# Altium schematic sheet Sheet2.SchDoc
size A4; SheetNumber: 2; SheetTotal: 2
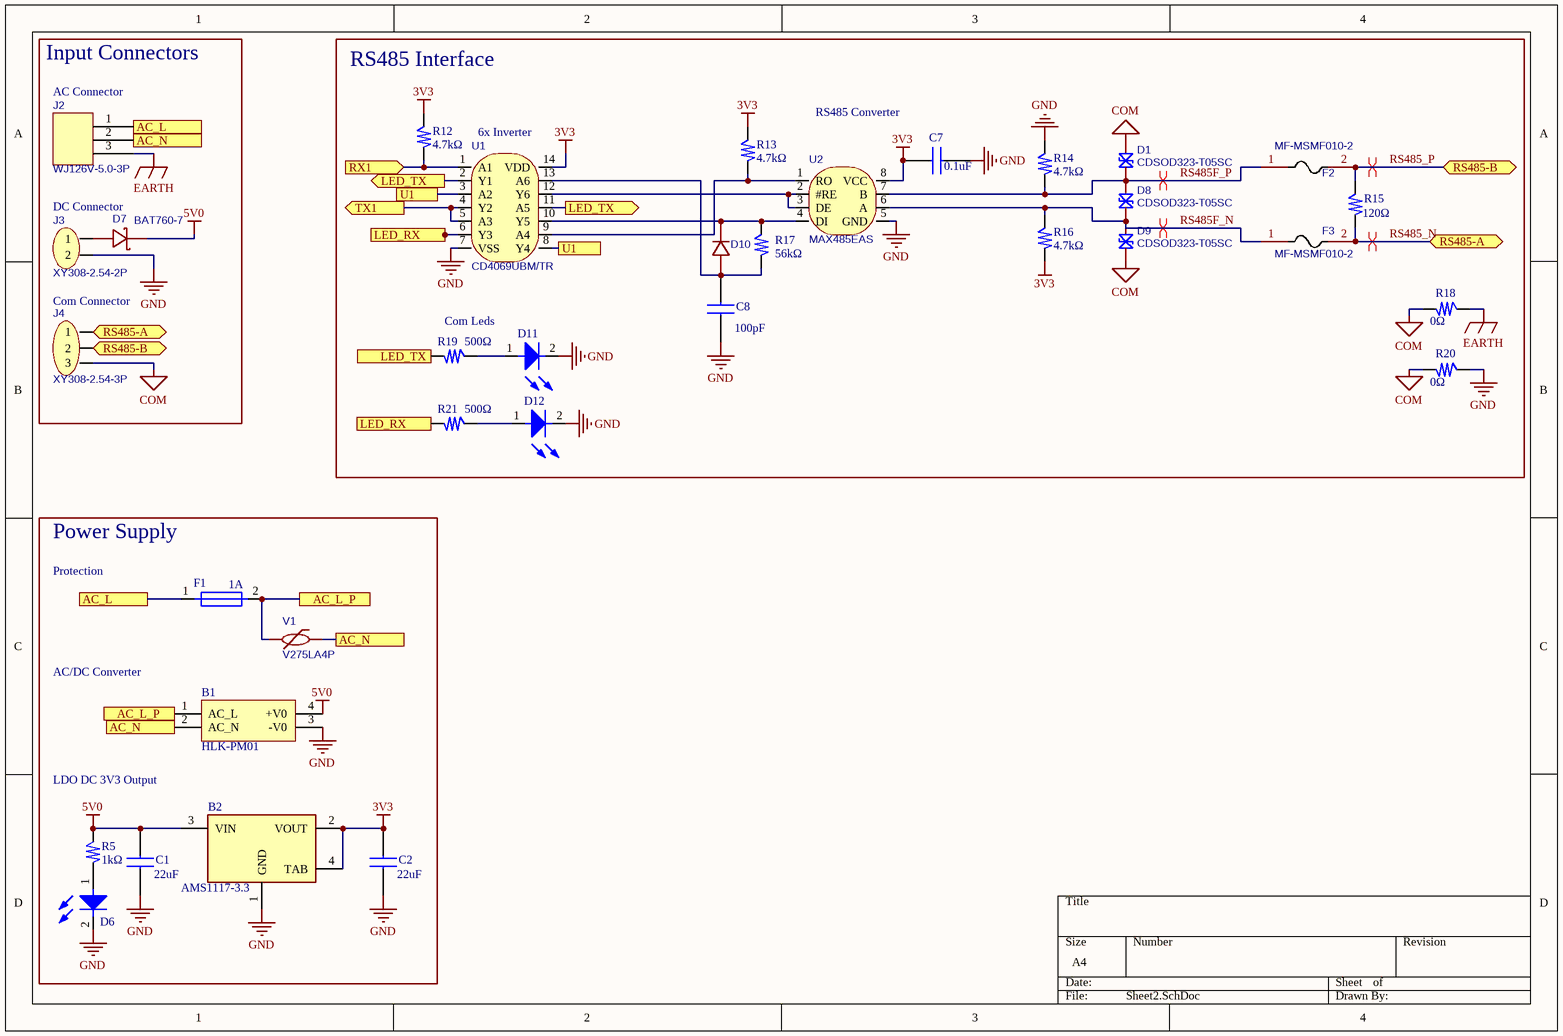
[diagram p0: Sheet2.SchDoc]

## Parts
B1  HLK-PM01  [HLKPM01]
B2  AMS1117-3.3  [SOT229P700X180-4N]
C1  value 22uF  [CAP0608N]  (hidden comment: CL10A226MP8NUNE)
C2  value 22uF  [CAP0608N]  (hidden comment: CL10A226MP8NUNE)
C7  value 0.1uF  [CAP0608N]  (hidden comment: CAP_0603_0.1UF_20%_50V_X5R)
C8  value 100pF  [CAP0608N]  (hidden comment: CAP_0603_100pF_5%_50V_C0G)
D1  CDSOD323-T05SC  [SOD-323_L1.8-W1.3-LS2.5-RD]
D6  0603_LED_GREEN_1.8V  [LED0603]  (value not drawn)
D7  BAT760-7  [SOD-323_L1.8-W1.3-LS2.5-RD]
D8  CDSOD323-T05SC  [SOD-323_L1.8-W1.3-LS2.5-RD]
D9  CDSOD323-T05SC  [SOD-323_L1.8-W1.3-LS2.5-RD]
D10  1N4148W T4  [SOD-123_L2.8-W1.8-LS3.7-RD]  (value not drawn)
D11  0603_LED_RED_1.9V  [LED0603]  (value not drawn)
D12  0603_LED_GREEN_1.8V  [LED0603]  (value not drawn)
F1  value 1A  [FUSE_TH_3x10]  (hidden comment: FUSE_TH_1A_GLASS)
F2  MF-MSMF010-2  [F1812]
F3  MF-MSMF010-2  [F1812]
J2  WJ126V-5.0-3P  [CONN-TH_3P-P5.00_WJ126V-5.0-3P]
J3  XY308-2.54-2P  [CONN-TH_XY308-2.54-2P]
J4  XY308-2.54-3P  [CONN-TH_XY308-2.54-3P]
R5  value 1kΩ  [RES0603N]  (hidden comment: RES_0603_1KOHM_0.1W)
R12  value 4.7kΩ  [RES0603N]  (hidden comment: RES_0603_4.7KOHM_0.1W)
R13  value 4.7kΩ  [RES0603N]  (hidden comment: RES_0603_4.7KOHM_0.1W)
R14  value 4.7kΩ  [RES0603N]  (hidden comment: RES_0603_4.7KOHM_0.1W)
R15  value 120Ω  [RES0603N]  (hidden comment: RES_0603_120OHM_0.1W)
R16  value 4.7kΩ  [RES0603N]  (hidden comment: RES_0603_4.7KOHM_0.1W)
R17  value 56kΩ  [RES0603N]  (hidden comment: RES_0603_56KOHM_0.1W)
R18  value 0Ω  [RES0603N]  (hidden comment: RES_0603_0OHM_0.1W)
R19  value 500Ω  [RES0603N]  (hidden comment: RES_0603_500OHM_0.1W)
R20  value 0Ω  [RES0603N]  (hidden comment: RES_0603_0OHM_0.1W)
R21  value 500Ω  [RES0603N]  (hidden comment: RES_0603_500OHM_0.1W)
U1  CD4069UBM/TR  [SOIC-14_L8.7-W3.9-P1.27-LS6.0-BL]
U2  MAX485EAS  [SOP-8_L5.0-W4.0-P1.27-LS6.0-BL]
V1  V275LA4P  [RES-TH_L9.0-W5.6-P6.00-D1.0-S3.50]

## Blocks framed on the sheet
Input Connectors: D7 J2-J4
RS485 Interface: C7 C8 D1 D8-D12 F2 F3 R12-R21 U1 U2
Power Supply: B1 B2 C1 C2 D6 F1 R5 V1

## Ports
AC_L, AC_L_P, AC_N, LED_RX (in), LED_RX (out), LED_TX (in), LED_TX (out), RS485-A (bidir), RS485-B (bidir), RX1 (in), TX1 (out), U1

## Nets
3V3: B2.2(VOUT) B2.4(TAB) C2.2 C7.2 R12.2 R13.2 R16.1 U1.14(VDD) U2.8(VCC)
5V0: B1.4(+V0) B2.3(VIN) C1.2 D7.1 R5.2
COM: D1.1(K) D9.2(A) J4.3 R18.1 R20.1
EARTH: J2.3 R18.2
GND: B1.3(-V0) B2.1(GND) C1.1 C2.1 C7.1 C8.2 D6.2(K) D11.2(K) D12.2(K) J3.2 R14.2 R20.2 U1.7(VSS) U2.5(GND)
AC_L: F1.1 J2.1 ; port AC_L
AC_L_P: B1.1(AC_L) F1.2 V1.2 ; port AC_L_P
AC_N: B1.2(AC_N) J2.2 V1.1 ; port AC_N
LED_RX: R21.1 U1.6(Y3) ; port LED_RX
LED_TX: R19.1 U1.2(Y1) U1.11(A5) ; port LED_TX
RS485_N: F3.2 J4.1 R15.1 ; port RS485-A
RS485_P: F2.2 J4.2 R15.2 ; port RS485-B
RS485F_N: D8.2(A) D9.1(K) F3.1 R16.2 U2.6(A)
RS485F_P: D1.2(A) D8.1(K) F2.1 R14.1 U2.7(B)
RX1: R12.1 U1.1(A1) ; port RX1
TX1: U1.4(Y2) U1.5(A3) ; port TX1
U1: U1.3(A2) U1.8(Y4) ; port U1
NetC8_1: C8.1 D10.2(A) R17.1 U1.13(A6)
NetD6_1: D6.1(A) R5.1
NetD7_2: D7.2 J3.1
NetD10_1: D10.1(K) R17.2 U1.10(Y5) U2.4(DI)
NetD11_1: D11.1(A) R19.2
NetD12_1: D12.1(A) R21.2
NetR13_1: R13.1 U1.9(A4) U2.1(RO)
NetU1_12: U1.12(Y6) U2.2(#RE) U2.3(DE)

## Layout directives
differential pair: RS485_N, RS485_P, RS485F_N, RS485F_P

## Notes on the sheet
- (near J2) AC Connector
- RS485 Converter
- (near U1) 6x Inverter
- DC Connector
- (near J4) Com Connector
- Com Leds
- Protection
- AC/DC Converter
- LDO DC 3V3 Output

## Library data of the parts
B1 = HLK-PM01: 3W Ultra-compact power module / In: 100-240Vac / Out: 5Vdc 0.6A; Manufacturer_Name: Hi-Link; Geometry.Height: 15mm; Manufacturer_Part_Number: HLK-PM01; Datasheet Link: https://datasheet.lcsc.com/szlcsc/1906201102_HI-LINK-HLK-PM03_C209904.pdf
B2 = AMS1117-3.3: 1A 3.3VDC LOW DROPOUT VOLTAGE REGULATOR, SOT-223; Manufacturer_Name: Advanced Monolithic Systems; Manufacturer_Part_Number: ams1117-3.3v; Geometry.Height: 1.8mm; Datasheet Link: http://www.advanced-monolithic.com/pdf/ds1117.pdf
C1 C2 = CL10A226MP8NUNE: Condensadores de cerámica multicapa (MLCC- SMD/SMT) 22uF+/-20% 10V X5R 0603; Manufacturer_Name: SAMSUNG; Geometry.Height: 1.05mm; Mouser Part Number: 187-CL10A226MP8NUNE; Mouser Price/Stock: https://www.mouser.co.uk/ProductDetail/Samsung-Electro-Mechanics/CL10A226MP8NUNE?qs=gRKWieUq2Hb5O0PTfRKzDQ%3D%3D; Manufacturer_Part_Number: CL10A226MP8NUNE; Datasheet Link: https://datasheet.datasheetarchive.com/originals/distributors/Datasheets-DGA10/2407063.pdf
C7 = CAP_0603_0.1UF_20%_50V_X5R: Condensadores de cerámica multicapa (MLCC- SMD/SMT) 0.1uF+/-20% 50V X5R 0603; Manufacturer_Name: SAMSUNG; Manufacturer_Part_Number: CL10A226MP8NUNE; Geometry.Height: 1.05mm; Mouser Part Number: 187-CL10A226MP8NUNE; Mouser Price/Stock: https://www.mouser.co.uk/ProductDetail/Samsung-Electro-Mechanics/CL10A226MP8NUNE?qs=gRKWieUq2Hb5O0PTfRKzDQ%3D%3D; Datasheet Link: https://datasheet.datasheetarchive.com/originals/distributors/Datasheets-DGA10/2407063.pdf
C8 = CAP_0603_100pF_5%_50V_C0G: Condensadores de cerámica multicapa (MLCC- SMD/SMT) 0.1uF+/-5% 50V C0G 0603; Manufacturer_Name: SAMSUNG; Manufacturer_Part_Number: CL10A226MP8NUNE; Geometry.Height: 1.05mm; Mouser Part Number: 187-CL10A226MP8NUNE; Mouser Price/Stock: https://www.mouser.co.uk/ProductDetail/Samsung-Electro-Mechanics/CL10A226MP8NUNE?qs=gRKWieUq2Hb5O0PTfRKzDQ%3D%3D; Datasheet Link: https://datasheet.datasheetarchive.com/originals/distributors/Datasheets-DGA10/2407063.pdf
D1 D8 D9 = CDSOD323-T05SC: 14.5V 6V 5V SOD-323 TVS ROHS; Manufacturer: BOURNS; Contributor: lcsc; Supplier: LCSC; Supplier Part: C840636; MPN: CDSOD323-T05SC; JLCPCB Part Class: Extended Part; spicePre: D; spiceSymbolName: CDSOD323-T05SC
D6 D12 = MHT192JGCT: 0603 Green Led; Geometry.Height: 0.8mm
D7 = BAT760-7: 30V 550mV@1A 1A SOD-323 Schottky Barrier Diodes (SBD) ROHS; Manufacturer: Diodes Incorporated; Contributor: LCSC; Supplier: LCSC; MPN: BAT760-7; Supplier Part: C124187; JLCPCB Part Class: Extended Part; spicePre: D; spiceSymbolName: BAT760-7
D10 = 1N4148W T4: Diode 100V 500mW Single 1.25V@150mA 4ns 150mA SOD-123 Switching Diode ROHS; Manufacturer: CJ; Supplier: LCSC; MPN: 1N4148W; Supplier Part: C2099; JLCPCB Part Class: Extended Part; spicePre: D; spiceSymbolName: 1N4148W T4
D11 = MHT192CRCT: 0603 Red Led; Geometry.Height: 0.8mm
F1 = FUSE_TH_10x3_GLASS: Fuse 1A AC250V; MPN: 31FC1A250V; Manufacturer: Hongda
F2 F3 = MF-MSMF010-2: Resettable Fuses 60V 100mA 40A 300mA 1812 Resettable Fuses ROHS; Manufacturer: BOURNS; Supplier: LCSC; MPN: MF-MSMF010-2; Supplier Part: C12430; JLCPCB Part Class: Extended Part; spicePre: F; spiceSymbolName: MF-MSMF010-2
J2 = WJ126V-5.0-3P: 1x3P 18A -40℃~+105℃ 250V Green 14~26 Straight pin 5mm 2.5 1 3 Plugin,P=5mm Screw terminal ROHS; Manufacturer: KANGNEX; Supplier: LCSC; MPN: WJ126V-5.0-3P; Supplier Part: C8401; JLCPCB Part Class: Extended Part; spicePre: P; spiceSymbolName: WJ126V-5.0-3P
J3 = XY308-2.54-2P: 1x2P 6A 150V Green 18~26 Straight pin 2.54mm 1 1 2 Plugin,P=2.54mm Screw terminal ROHS; Manufacturer: XINLAIYA; Contributor: LCSC; Supplier: LCSC; Supplier Part: C557685; MPN: XY308-2.54-2P; JLCPCB Part Class: Extended Part; spicePre: U; spiceSymbolName: XY308-2.54-2P
J4 = XY308-2.54-3P: Screw Terminal 1x3P 6A 150V Green 18~26 Straight pin 2.54mm 1 1 3 Plugin,P=2.54mm ROHS; Manufacturer: XINLAIYA; Contributor: LCSC; Supplier: LCSC; Supplier Part: C557686; MPN: XY308-2.54-3P; JLCPCB Part Class: Extended Part; spicePre: U; spiceSymbolName: XY308-2.54-3P
R5 = RES_0603_1KOHM_0.1W: Res Thick Film 0603 1K Ohm 1% 0.1W(1/10W) +/-100ppm/C Epoxy Pad SMD T/R; Manufacturer_Name: YAGEO; Manufacturer_Part_Number: RC0603FR-071KL; Geometry.Height: 0.55mm; Mouser Part Number: 603-RC0603FR-071KL; Mouser Price/Stock: https://www.mouser.co.uk/ProductDetail/YAGEO/RC0603FR-071KL?qs=VU8sRB4EgwApHsk4rF%2F3zg%3D%3D; Datasheet Link: https://www.yageo.com/upload/media/product/productsearch/datasheet/rchip/PYu-RC_Group_51_RoHS_L_12.pdf; MPN: RC0603FR-071KL; Manufacturer: Yageo
R12-R14 R16 = RES_0603_4.7KOHM_0.1W: Res Thick Film 0603 4.7K Ohm 1% 0.1W(1/10W) +/-100ppm/C Epoxy Pad SMD T/R; Manufacturer_Name: YAGEO; Manufacturer_Part_Number: RC0603FR-071KL; MPN: RT0603FRE075K1L; Geometry.Height: 0.55mm; Mouser Part Number: 603-RC0603FR-071KL; Mouser Price/Stock: https://www.mouser.co.uk/ProductDetail/YAGEO/RC0603FR-071KL?qs=VU8sRB4EgwApHsk4rF%2F3zg%3D%3D; Datasheet Link: https://www.yageo.com/upload/media/product/productsearch/datasheet/rchip/PYu-RC_Group_51_RoHS_L_12.pdf; Manufacturer: Yageo
R15 = RES_0603_120OHM_0.1W: Res Thick Film 0603 120 Ohm 1% 0.1W(1/10W) +/-100ppm/C Epoxy Pad SMD T/R; Manufacturer_Name: YAGEO; Manufacturer_Part_Number: RC0603FR-071KL; MPN: RT0603FRE075K1L; Geometry.Height: 0.55mm; Mouser Part Number: 603-RC0603FR-071KL; Mouser Price/Stock: https://www.mouser.co.uk/ProductDetail/YAGEO/RC0603FR-071KL?qs=VU8sRB4EgwApHsk4rF%2F3zg%3D%3D; Datasheet Link: https://www.yageo.com/upload/media/product/productsearch/datasheet/rchip/PYu-RC_Group_51_RoHS_L_12.pdf; Manufacturer: Yageo
R17 = RES_0603_56KOHM_0.1W: Res Thick Film 0603 56K Ohm 1% 0.1W(1/10W) +/-100ppm/C Epoxy Pad SMD T/R; Manufacturer_Name: YAGEO; Manufacturer_Part_Number: RC0603FR-071KL; MPN: RT0603FRE075K1L; Geometry.Height: 0.55mm; Mouser Part Number: 603-RC0603FR-071KL; Mouser Price/Stock: https://www.mouser.co.uk/ProductDetail/YAGEO/RC0603FR-071KL?qs=VU8sRB4EgwApHsk4rF%2F3zg%3D%3D; Datasheet Link: https://www.yageo.com/upload/media/product/productsearch/datasheet/rchip/PYu-RC_Group_51_RoHS_L_12.pdf; Manufacturer: Yageo
R18 R20 = RES_0603_0HM_0.1W_1: Res Thick Film 0603 0 Ohm 1% 0.1W(1/10W) +/-100ppm/C Epoxy Pad SMD T/R; Manufacturer_Name: YAGEO; Manufacturer_Part_Number: RC0603FR-071KL; MPN: RT0603FRE075K1L; Geometry.Height: 0.55mm; Mouser Part Number: 603-RC0603FR-071KL; Mouser Price/Stock: https://www.mouser.co.uk/ProductDetail/YAGEO/RC0603FR-071KL?qs=VU8sRB4EgwApHsk4rF%2F3zg%3D%3D; Datasheet Link: https://www.yageo.com/upload/media/product/productsearch/datasheet/rchip/PYu-RC_Group_51_RoHS_L_12.pdf; Manufacturer: Yageo
R19 R21 = RES_0603_500OHM_0.1W: Res Thick Film 0603 500 Ohm 1% 0.1W(1/10W) +/-100ppm/C Epoxy Pad SMD T/R; Manufacturer_Name: YAGEO; Manufacturer_Part_Number: RC0603FR-071KL; MPN: RT0603FRE075K1L; Geometry.Height: 0.55mm; Mouser Part Number: 603-RC0603FR-071KL; Mouser Price/Stock: https://www.mouser.co.uk/ProductDetail/YAGEO/RC0603FR-071KL?qs=VU8sRB4EgwApHsk4rF%2F3zg%3D%3D; Datasheet Link: https://www.yageo.com/upload/media/product/productsearch/datasheet/rchip/PYu-RC_Group_51_RoHS_L_12.pdf; Manufacturer: Yageo
U1 = CD4069UBM/TR: SOIC-14 Inverters ROHS; Manufacturer: HGSEMI; Contributor: LCSC; Supplier: LCSC; Supplier Part: C194330; MPN: CD4069UBM/TR; JLCPCB Part Class: Extended Part; spicePre: U; spiceSymbolName: CD4069UBM/TR
U2 = MAX485EAS: SOP-8 RS-485/RS-422 ICs ROHS; Manufacturer: UMW; MPN: MAX485ESA; Contributor: LCSC; Supplier: LCSC; Supplier Part: C668206; JLCPCB Part Class: Extended Part; spicePre: U; spiceSymbolName: MAX485EAS
V1 = V275LA4P: Plugin Varistors 275Vrms  ROHS; Manufacturer: Littelfuse; Contributor: LCSC; Supplier: LCSC; Supplier Part: C129558; MPN: V275LA4P; JLCPCB Part Class: Extended Part; spicePre: R; spiceSymbolName: V275LA4P